# Altium schematic sheet Var5.SchDoc
size A4; SheetNumber: 8; SheetTotal: 12
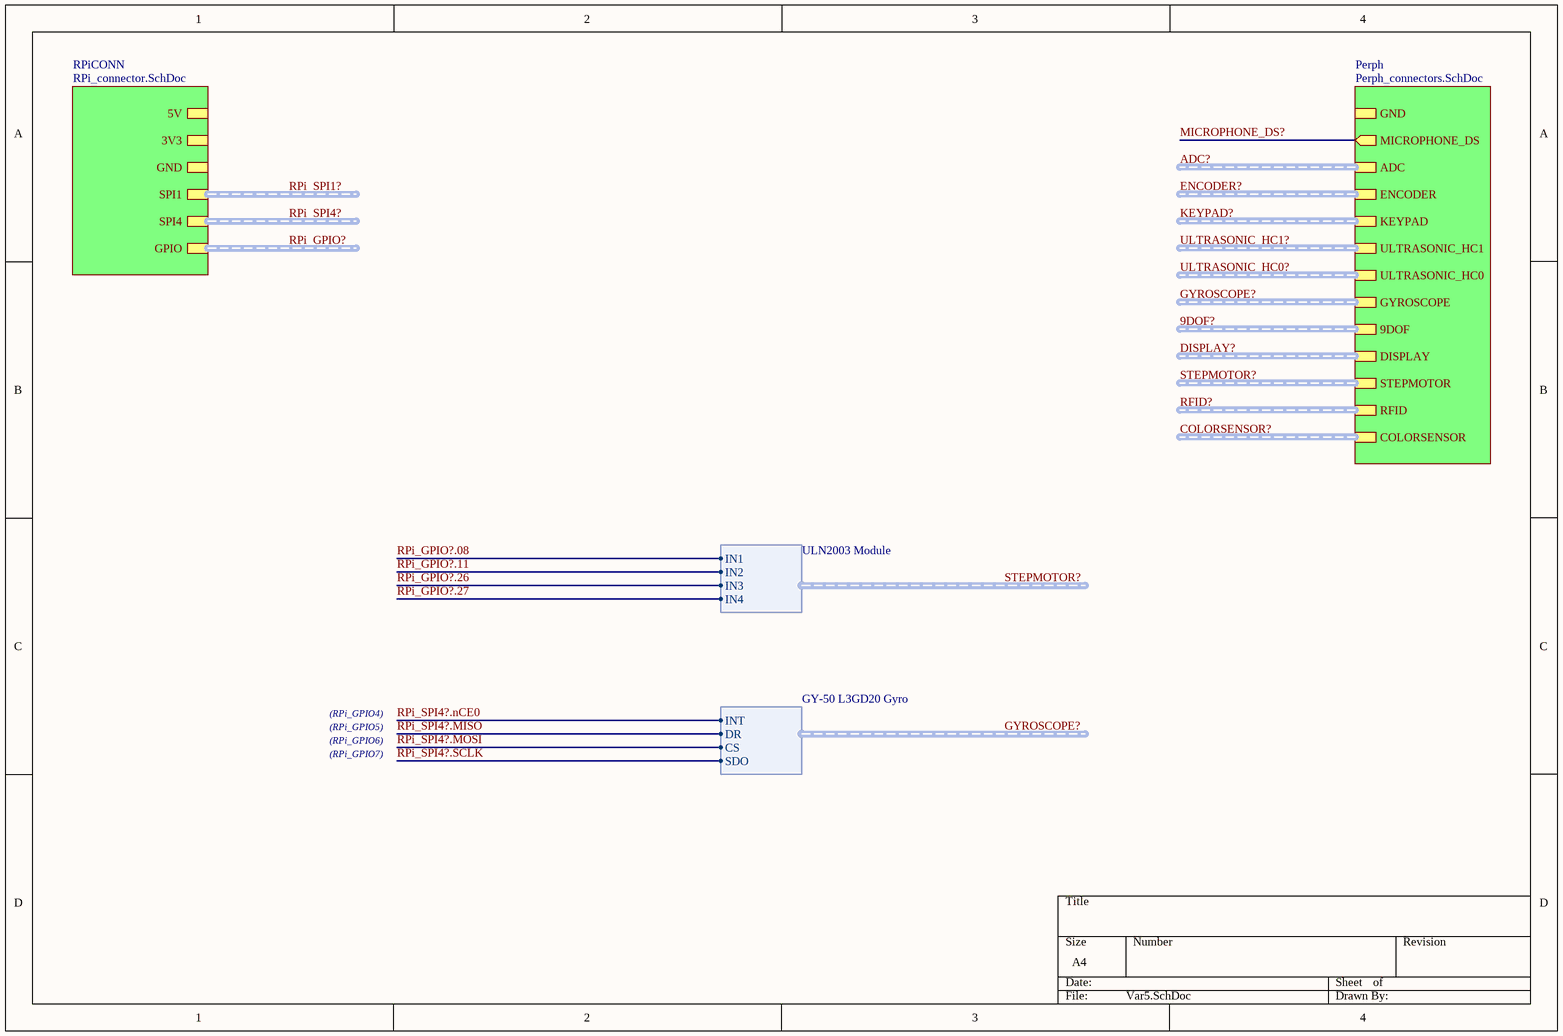
[diagram p0: Var5.SchDoc]

## Sub-sheets
Perph = Perph_connectors.SchDoc: MICROPHONE_DS (out), ADC (harness ADS1115 module), GYROSCOPE (harness GY-50 L3GD20 Gyro), ULTRASONIC_HC1 (harness HC-SR04), GND, KEYPAD (harness Keypad COM-08653), ULTRASONIC_HC0 (harness HC-SR04), DISPLAY (harness MSP3520), STEPMOTOR (harness ULN2003 Module), RFID (harness RC522), ENCODER (harness KY-040), COLORSENSOR (harness TCS34725), 9DOF (harness 9DOF)
RPiCONN = RPi_connector.SchDoc: 5V, 3V3, GND, SPI4 (harness SPI_2CS), SPI1 (harness SPI_3CS), GPIO (harness RPI_GPIO)

## Harnesses
ULN2003 Module: IN1, IN2, IN3, IN4
GY-50 L3GD20 Gyro: SDO, CS, DR, INT

## Nets
MICROPHONE_DS?: sheet Perph/MICROPHONE_DS
RPi_GPIO?.08: sheet Perph/STEPMOTOR.IN1
RPi_GPIO?.11: sheet Perph/STEPMOTOR.IN2
RPi_GPIO?.26: sheet Perph/STEPMOTOR.IN3
RPi_GPIO?.27: sheet Perph/STEPMOTOR.IN4
RPi_SPI4?.MISO: sheet Perph/GYROSCOPE.DR  [project net GYROSCOPE?.DR]
RPi_SPI4?.MOSI: sheet Perph/GYROSCOPE.CS  [project net GYROSCOPE?.CS]
RPi_SPI4?.nCE0: sheet Perph/GYROSCOPE.INT  [project net GYROSCOPE?.INT]
RPi_SPI4?.SCLK: sheet Perph/GYROSCOPE.SDO  [project net GYROSCOPE?.SDO]

## Buses and harness runs
harness 9DOF? = sheet Perph/9DOF
harness ADC? = sheet Perph/ADC
harness COLORSENSOR? = sheet Perph/COLORSENSOR
harness DISPLAY? = sheet Perph/DISPLAY
harness ENCODER? = sheet Perph/ENCODER
harness GYROSCOPE? = sheet Perph/GYROSCOPE
harness KEYPAD? = sheet Perph/KEYPAD
harness RFID? = sheet Perph/RFID
harness RPi_GPIO? = sheet RPiCONN/GPIO
harness RPi_SPI1? = sheet RPiCONN/SPI1
harness RPi_SPI4? = sheet RPiCONN/SPI4
harness STEPMOTOR? = sheet Perph/STEPMOTOR
harness ULTRASONIC_HC0? = sheet Perph/ULTRASONIC_HC0
harness ULTRASONIC_HC1? = sheet Perph/ULTRASONIC_HC1

## Notes on the sheet
- (RPi_GPIO4)
- (RPi_GPIO5)
- (RPi_GPIO6)
- (RPi_GPIO7)